# Altium schematic sheet tb6612fng.SchDoc
size A4; SheetNumber: 3; SheetTotal: 3
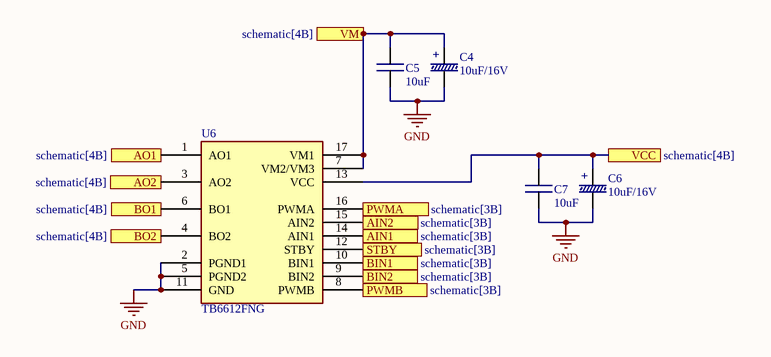
[diagram p0: tb6612fng.SchDoc]

## Parts
C4  10uF/16V  [ALUMINUM_4mm]
C5  10uF  [CAPACITOR 0805]
C6  10uF/16V  [ALUMINUM_4mm]
C7  10uF  [CAPACITOR 0805]
U6  TB6612FNG  [TB6612FNG]

## Ports
AIN1 (see schematic[3B]), AIN2 (see schematic[3B]), AO1 (see schematic[4B]), AO2 (see schematic[4B]), BIN1 (see schematic[3B]), BIN2 (see schematic[3B]), BO1 (see schematic[4B]), BO2 (see schematic[4B]), PWMA (see schematic[3B]), PWMB (see schematic[3B]), STBY (see schematic[3B]), VCC (see schematic[4B]), VM (see schematic[4B])

## Nets
GND: C4.2 C5.1 C6.2 C7.1 U6.2(PGND1) U6.5(PGND2) U6.11(GND)
AIN1: U6.14(AIN1) ; port AIN1
AIN2: U6.15(AIN2) ; port AIN2
AO1: U6.1(AO1) ; port AO1
AO2: U6.3(AO2) ; port AO2
BIN1: U6.10(BIN1) ; port BIN1
BIN2: U6.9(BIN2) ; port BIN2
BO1: U6.6(BO1) ; port BO1
BO2: U6.4(BO2) ; port BO2
PWMA: U6.16(PWMA) ; port PWMA
PWMB: U6.8(PWMB) ; port PWMB
STBY: U6.12(STBY) ; port STBY
VCC: C6.1 C7.2 U6.13(VCC) ; port VCC
VM: C4.1 C5.2 U6.7(VM2/VM3) U6.17(VM1) ; port VM

## Notes on the sheet
- (in symbol 10uF/16V) +

## Library data of the parts
C4 C6 = 10uF/16V: Aluminum Capacitor 10uF/16V 4mm
C5 C7 = CAPACITOR 0805: Generic Capacitor 0805, 2x1.25x1.4mm.
U6 = TB6612FNG: Dual Motor Driver 2.7-5.5V Logic 2.5-13.5V Motor 1A Continuos 3.2A Peak SSOP24; ComponentLink1Description: Datasheet; ComponentLink1URL: https://www.mouser.com/datasheet/2/408/TB6612FNG_datasheet_en_20141001-708260.pdf; Mouser PN: 757-TB6612FNGC8EL; Digikey PN: TB6612FNGC8ELCT-ND; JLCPCB PN: C141517